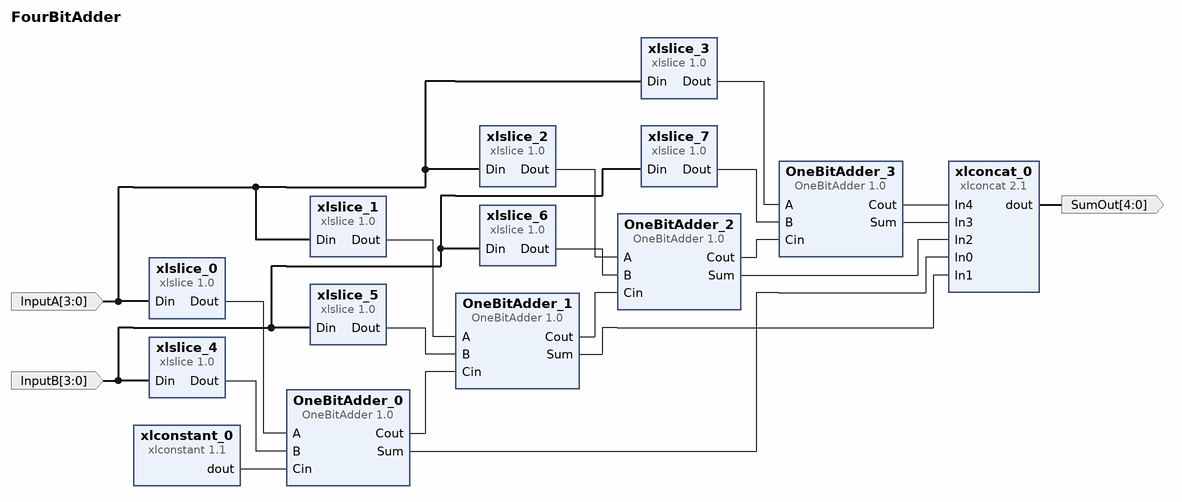
[diagram p0: block diagram of the top level]
# Vivado block design FourBitAdder, xc7a100tcsg324-1, Vivado 2023.1
create_bd_design FourBitAdder

create_bd_port -dir I -from 3 -to 0 InputA
create_bd_port -dir I -from 3 -to 0 InputB
create_bd_port -dir O -from 4 -to 0 SumOut

create_bd_cell -type ip -vlnv Youssef:user:OneBitAdder:1.0 OneBitAdder_0
create_bd_cell -type ip -vlnv Youssef:user:OneBitAdder:1.0 OneBitAdder_1
create_bd_cell -type ip -vlnv Youssef:user:OneBitAdder:1.0 OneBitAdder_2
create_bd_cell -type ip -vlnv Youssef:user:OneBitAdder:1.0 OneBitAdder_3
create_bd_cell -type ip -vlnv xilinx.com:ip:xlslice:1.0 xlslice_0
set_property -dict {CONFIG.DIN_WIDTH 4} [get_bd_cells xlslice_0]
create_bd_cell -type ip -vlnv xilinx.com:ip:xlconcat:2.1 xlconcat_0
set_property -dict {CONFIG.NUM_PORTS 5} [get_bd_cells xlconcat_0]
create_bd_cell -type ip -vlnv xilinx.com:ip:xlslice:1.0 xlslice_1
set_property -dict {CONFIG.DIN_TO 1 CONFIG.DIN_WIDTH 4} [get_bd_cells xlslice_1]
create_bd_cell -type ip -vlnv xilinx.com:ip:xlslice:1.0 xlslice_2
set_property -dict {CONFIG.DIN_FROM 2 CONFIG.DIN_TO 2 CONFIG.DIN_WIDTH 4} [get_bd_cells xlslice_2]
create_bd_cell -type ip -vlnv xilinx.com:ip:xlslice:1.0 xlslice_3
set_property -dict {CONFIG.DIN_TO 3 CONFIG.DIN_WIDTH 4} [get_bd_cells xlslice_3]
create_bd_cell -type ip -vlnv xilinx.com:ip:xlslice:1.0 xlslice_4
set_property -dict {CONFIG.DIN_WIDTH 4} [get_bd_cells xlslice_4]
create_bd_cell -type ip -vlnv xilinx.com:ip:xlslice:1.0 xlslice_5
set_property -dict {CONFIG.DIN_TO 1 CONFIG.DIN_WIDTH 4} [get_bd_cells xlslice_5]
create_bd_cell -type ip -vlnv xilinx.com:ip:xlslice:1.0 xlslice_6
set_property -dict {CONFIG.DIN_FROM 2 CONFIG.DIN_TO 2 CONFIG.DIN_WIDTH 4} [get_bd_cells xlslice_6]
create_bd_cell -type ip -vlnv xilinx.com:ip:xlslice:1.0 xlslice_7
set_property -dict {CONFIG.DIN_TO 3 CONFIG.DIN_WIDTH 4} [get_bd_cells xlslice_7]
create_bd_cell -type ip -vlnv xilinx.com:ip:xlconstant:1.1 xlconstant_0
set_property -dict {CONFIG.CONST_VAL 0} [get_bd_cells xlconstant_0]

# ---- connections ----

connect_bd_net [get_bd_ports InputA] [get_bd_pins xlslice_0/Din] [get_bd_pins xlslice_1/Din] [get_bd_pins xlslice_2/Din] [get_bd_pins xlslice_3/Din]
connect_bd_net [get_bd_ports InputB] [get_bd_pins xlslice_7/Din] [get_bd_pins xlslice_6/Din] [get_bd_pins xlslice_5/Din] [get_bd_pins xlslice_4/Din]
connect_bd_net [get_bd_pins OneBitAdder_0/Cout] [get_bd_pins OneBitAdder_1/Cin]
connect_bd_net [get_bd_pins OneBitAdder_0/Sum] [get_bd_pins xlconcat_0/In0]
connect_bd_net [get_bd_pins OneBitAdder_1/Cout] [get_bd_pins OneBitAdder_2/Cin]
connect_bd_net [get_bd_pins OneBitAdder_1/Sum] [get_bd_pins xlconcat_0/In1]
connect_bd_net [get_bd_pins OneBitAdder_2/Cout] [get_bd_pins OneBitAdder_3/Cin]
connect_bd_net [get_bd_pins OneBitAdder_2/Sum] [get_bd_pins xlconcat_0/In2]
connect_bd_net [get_bd_pins OneBitAdder_3/Cout] [get_bd_pins xlconcat_0/In4]
connect_bd_net [get_bd_pins OneBitAdder_3/Sum] [get_bd_pins xlconcat_0/In3]
connect_bd_net [get_bd_pins xlconcat_0/dout] [get_bd_ports SumOut]
connect_bd_net [get_bd_pins xlconstant_0/dout] [get_bd_pins OneBitAdder_0/Cin]
connect_bd_net [get_bd_pins xlslice_0/Dout] [get_bd_pins OneBitAdder_0/A]
connect_bd_net [get_bd_pins xlslice_1/Dout] [get_bd_pins OneBitAdder_1/A]
connect_bd_net [get_bd_pins xlslice_2/Dout] [get_bd_pins OneBitAdder_2/A]
connect_bd_net [get_bd_pins xlslice_3/Dout] [get_bd_pins OneBitAdder_3/A]
connect_bd_net [get_bd_pins xlslice_4/Dout] [get_bd_pins OneBitAdder_0/B]
connect_bd_net [get_bd_pins xlslice_5/Dout] [get_bd_pins OneBitAdder_1/B]
connect_bd_net [get_bd_pins xlslice_6/Dout] [get_bd_pins OneBitAdder_2/B]
connect_bd_net [get_bd_pins xlslice_7/Dout] [get_bd_pins OneBitAdder_3/B]

validate_bd_design
save_bd_design
